# Altium project ALTIUM_{TEX139}_HV-1PH-DCAC-R3.PrjPcb (part 1 of 2)
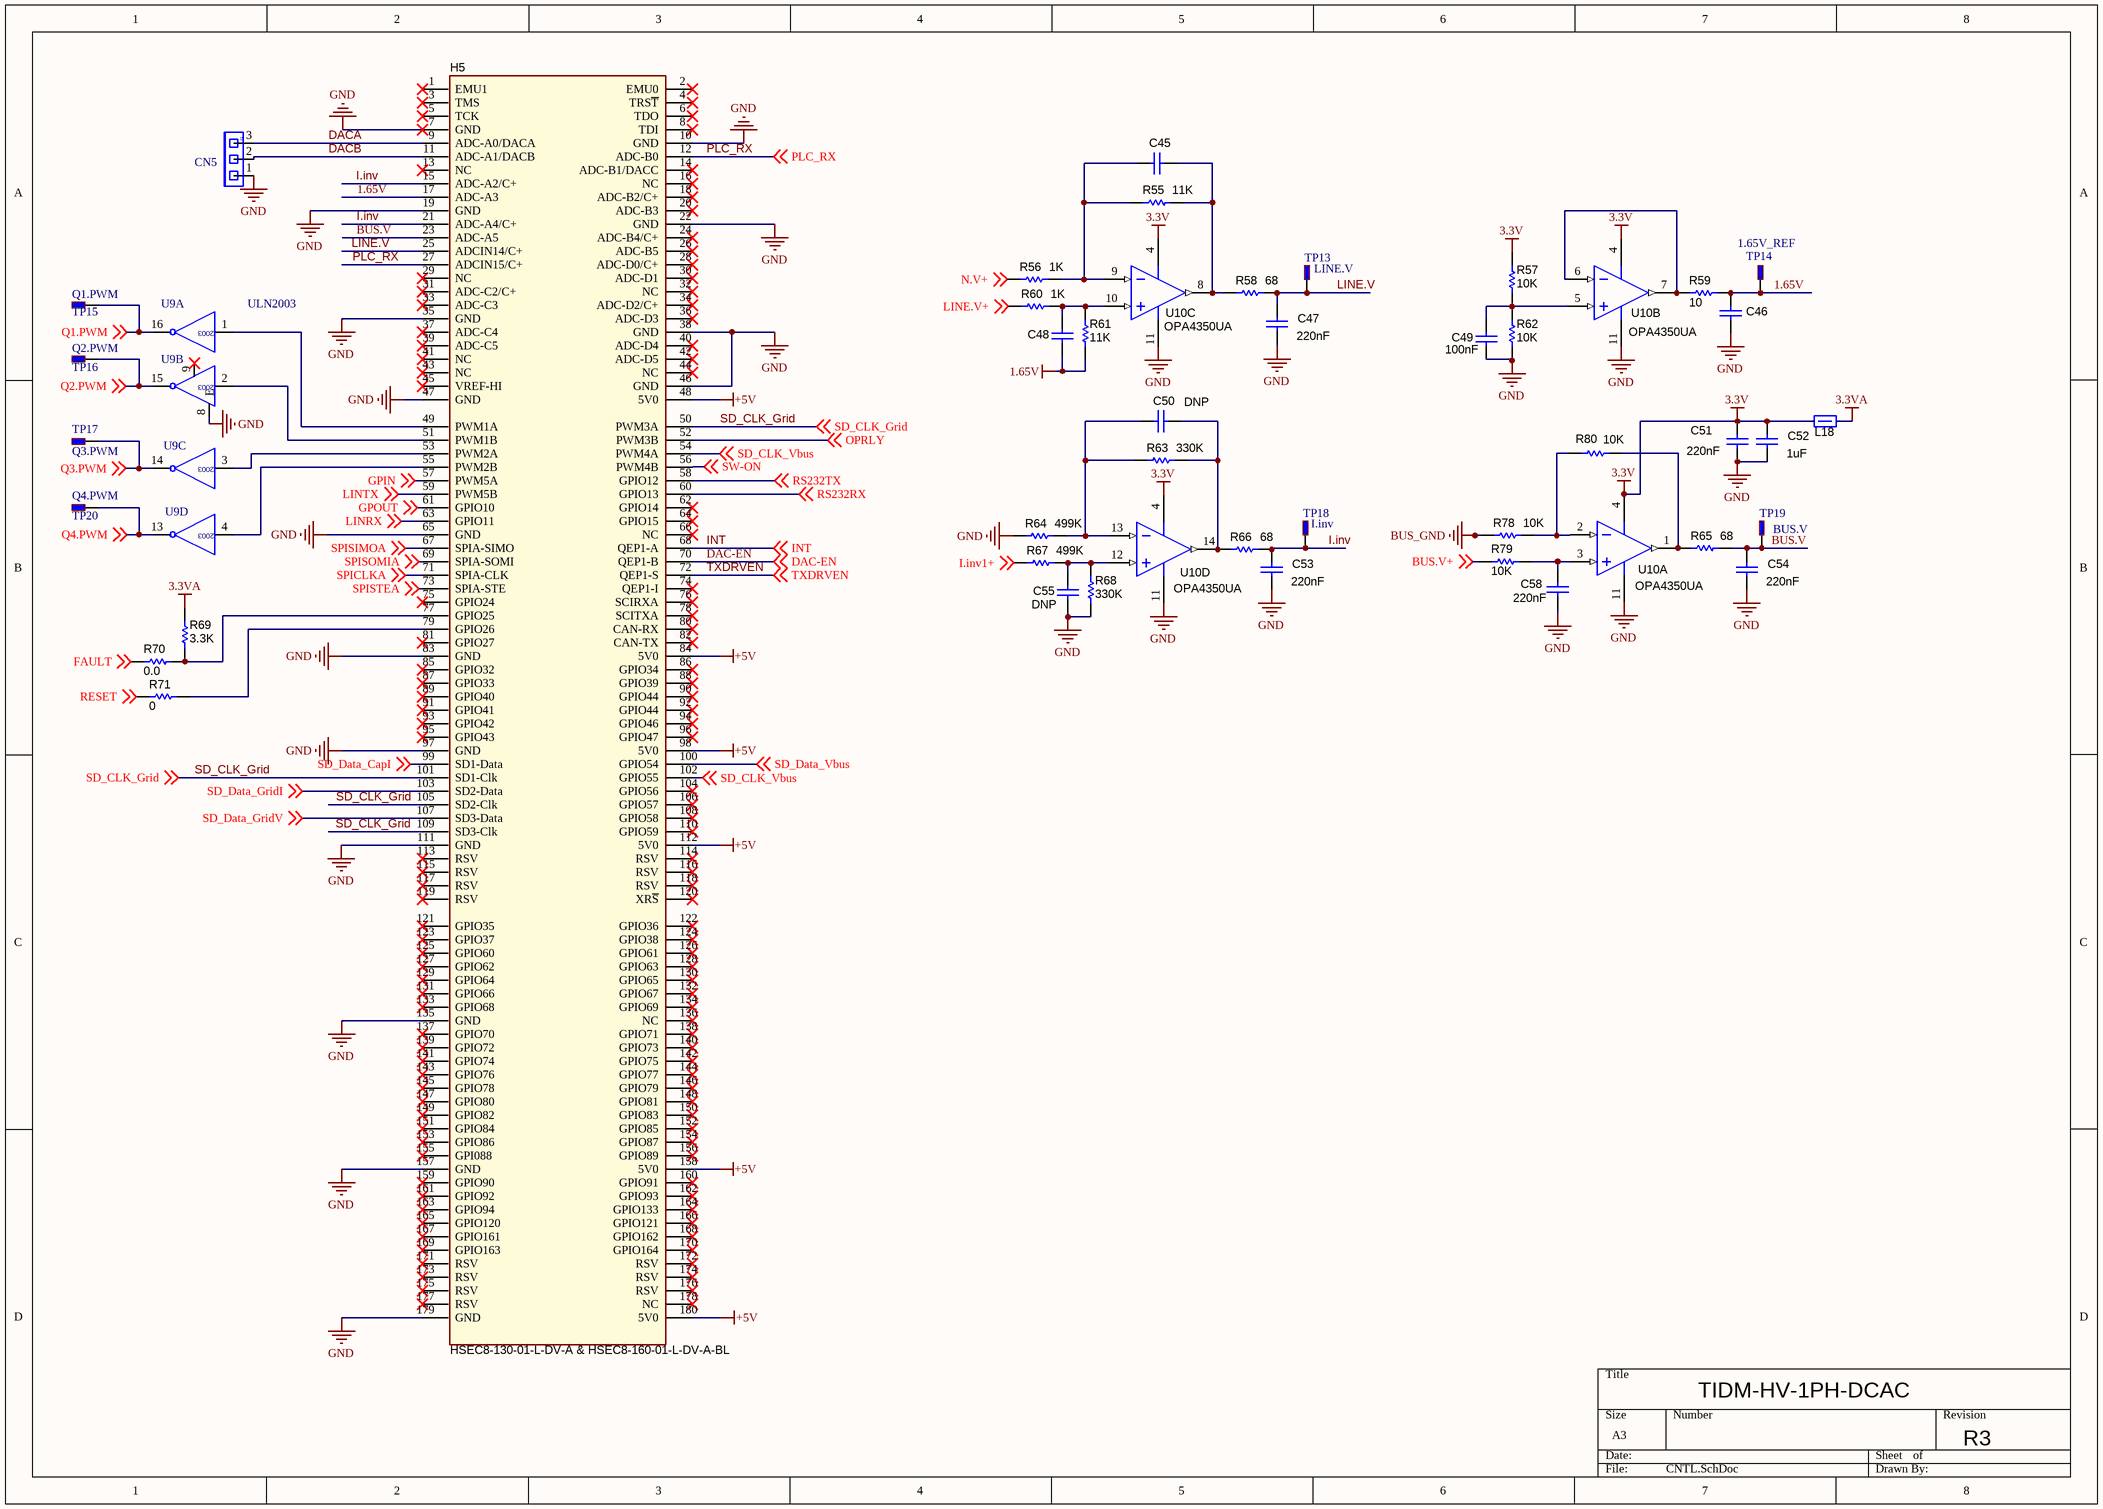
[diagram p0: CNTL.SchDoc]
3 sheets, 245 parts. Net scope: global (net labels, ports and power ports of the same name join across sheets).
Board file: ALTIUM_{TEX139}_HV-1PH-DCAC-R3.PcbDoc
Sheets:
  CNTL.SchDoc
  Main.SchDoc
  JTAG-USB-POWER.SchDoc

## Sheet CNTL.SchDoc
size A3; PageSetup: Record=PageOptions|CenterHorizontal=True|CenterVertical=True|PrintScale=0.25|XCorrection=1.00|YCorrection=1.00|PrintKind=1|BorderSize=5000000|LeftOffset=0|BottomOffset=0|Orientation=2|PaperLength=1000|PaperWidth=1000|Scale=100|PaperSource=15|PrintQuality=600|MediaType=1|DitherType=10|PaperKind=Legal|PrintScaleMode=1

### Parts
C45  Used in BOM report  [0603]  (value not drawn)
C46  Used in BOM report  [0603]  (value not drawn)
C47  value 220nF  [0603]  (hidden comment: Used in BOM report)
C48  Used in BOM report  [0603]  (value not drawn)
C49  value 100nF  [0603]  (hidden comment: Used in BOM report)
C50  value DNP  [0603]  (hidden comment: Used in BOM report)
C51  value 220nF  [0603]  (hidden comment: Used in BOM report)
C52  value 1uF  [0603]  (hidden comment: Used in BOM report)
C53  value 220nF  [0603]  (hidden comment: Used in BOM report)
C54  value 220nF  [0603]  (hidden comment: Used in BOM report)
C55  value DNP  [0603]  (hidden comment: Used in BOM report)
C58  value 220nF  [0603]  (hidden comment: Used in BOM report)
CN5  SCI_PORT  [HDR1X3]  (value not drawn)
H5  HSEC8-130-01-L-DV-A & HSEC8-160-01-L-DV-A-BL  [HEADER_HSEC8_180_DV]
L18  LQM21FN220N00L  [0805]  (value not drawn)
R55  value 11K  [0603]  (hidden comment: Used in BOM report)
R56  value 1K  [0603]  (hidden comment: Used in BOM report)
R57  value 10K  [0603]  (hidden comment: Used in BOM report)
R58  value 68  [0603]  (hidden comment: Used in BOM report)
R59  value 10  [0603]  (hidden comment: Used in BOM report)
R60  value 1K  [0603]  (hidden comment: Used in BOM report)
R61  value 11K  [0603]  (hidden comment: Used in BOM report)
R62  value 10K  [0603]  (hidden comment: Used in BOM report)
R63  value 330K  [0603]  (hidden comment: Used in BOM report)
R64  value 499K  [0603]  (hidden comment: Used in BOM report)
R65  value 68  [0603]  (hidden comment: Used in BOM report)
R66  value 68  [0603]  (hidden comment: Used in BOM report)
R67  value 499K  [0603]  (hidden comment: Used in BOM report)
R68  value 330K  [0603]  (hidden comment: Used in BOM report)
R69  value 3.3K  [0805]  (hidden comment: RC0805JR-071R1L)
R70  value 0.0  [0805]  (hidden comment: RC0805JR-071R1L)
R71  value 0  [0805]  (hidden comment: RC0805JR-071R1L)
R78  value 10K  [0603]  (hidden comment: Used in BOM report)
R79  value 10K  [0603]  (hidden comment: Used in BOM report)
R80  value 10K  [0603]  (hidden comment: Used in BOM report)
TP13  LINE.V  [PIN1]
TP14  1.65V_REF  [PIN1]
TP15  Q1.PWM  [PIN1]
TP16  Q2.PWM  [PIN1]
TP17  Q3.PWM  [PIN1]
TP18  I.inv  [PIN1]
TP19  BUS.V  [PIN1]
TP20  Q4.PWM  [PIN1]
U9  ULN2003  [2003SM]  (value not drawn)  (parts A,B,C,D of 7)
U10  OPA4350UA  [D0014A_N]  (parts A,B,C,D of 4)

### Nets
1.65V: C46.1 C48.2 H5.17(ADC-A3) R59.1 R61.1 TP14.1
3.3V: C51.1 C52.1 L18.2 R57.2 U10.4(V+)
3.3VA: L18.1 R69.2
+5V: H5.48(5V0) H5.84(5V0) H5.98(5V0) H5.112(5V0) H5.158(5V0) H5.180(5V0)
BUS_GND: R78.1  [project net Q2PWM-]
GND: C46.2 C47.2 C49.2 C51.2 C52.2 C53.2 C54.2 C55.2 C58.2 CN5.1 H5.7(GND) H5.10(GND) H5.19(GND) H5.22(GND) H5.35(GND) H5.38(GND) H5.46(GND) H5.47(GND) H5.65(GND) H5.83(GND) H5.97(GND) H5.111(GND) H5.135(GND) H5.157(GND) H5.179(GND) R62.1 R64.1 R68.1 U9.8(E) U10.11(V-)
BUS.V: C54.1 H5.23(ADC-A5) R65.2 TP19.1
BUS.V+: R79.2 ; off-sheet BUS.V+
DAC-EN: H5.70(QEP1-B) ; off-sheet DAC-EN
DACA: CN5.3 H5.9(ADC-A0/DACA)
DACB: CN5.2 H5.11(ADC-A1/DACB)
FAULT: R70.1 ; off-sheet FAULT
GPIN: H5.57(PWM5A) ; off-sheet GPIN
GPOUT: H5.61(GPIO10) ; off-sheet GPOUT
I.inv: C53.1 H5.15(ADC-A2/C+) H5.21(ADC-A4/C+) R66.2 TP18.1
I.inv1+: R67.1 ; off-sheet I.inv1+
INT: H5.68(QEP1-A) ; off-sheet INT
LINE.V: C47.1 H5.25(ADCIN14/C+) R58.2 TP13.1
LINE.V+: R60.1 ; off-sheet LINE.V+
LINRX: H5.63(GPIO11) ; off-sheet LINRX
LINTX: H5.59(PWM5B) ; off-sheet LINTX
N.V+: R56.1 ; off-sheet N.V+
OPRLY: H5.52(PWM3B) ; off-sheet OPRLY
PLC_RX: H5.12(ADC-B0) H5.27(ADCIN15/C+) ; off-sheet PLC_RX
Q1.PWM: TP15.1 U9.16 ; off-sheet Q1.PWM
Q2.PWM: TP16.1 U9.15 ; off-sheet Q2.PWM
Q3.PWM: TP17.1 U9.14 ; off-sheet Q3.PWM
Q4.PWM: TP20.1 U9.13 ; off-sheet Q4.PWM
RESET: R71.1 ; off-sheet RESET
RS232RX: H5.60(GPIO13) ; off-sheet RS232RX
RS232TX: H5.58(GPIO12) ; off-sheet RS232TX
SD_CLK_Grid: H5.50(PWM3A) H5.101(SD1-Clk) H5.105(SD2-Clk) H5.109(SD3-Clk) ; off-sheet SD_CLK_Grid
SD_CLK_Vbus: H5.54(PWM4A) H5.102(GPIO55) ; off-sheet SD_CLK_Vbus
SD_DATA_CapI: H5.99(SD1-Data) ; off-sheet SD_Data_CapI
SD_DATA_GridI: H5.103(SD2-Data) ; off-sheet SD_Data_GridI
SD_DATA_GridV: H5.107(SD3-Data) ; off-sheet SD_Data_GridV
SD_DATA_Vbus: H5.100(GPIO54) ; off-sheet SD_Data_Vbus
SPICLKA: H5.71(SPIA-CLK) ; off-sheet SPICLKA
SPISIMOA: H5.67(SPIA-SIMO) ; off-sheet SPISIMOA
SPISOMIA: H5.69(SPIA-SOMI) ; off-sheet SPISOMIA
SPISTEA: H5.73(SPIA-STE) ; off-sheet SPISTEA
SW-ON: H5.56(PWM4B) ; off-sheet SW-ON
TXDRVEN: H5.72(QEP1-S) ; off-sheet TXDRVEN
NetC45_1: C45.1 R55.1 R56.2 U10.9(IN_C-)
NetC45_2: C45.2 R55.2 R58.1 U10.8(OUT_C)
NetC48_1: C48.1 R60.2 R61.2 U10.10(IN_C+)
NetC49_1: C49.1 R57.1 R62.2 U10.5(IN_B+)
NetC50_1: C50.1 R63.1 R64.2 U10.13(IN_D-)
NetC50_2: C50.2 R63.2 R66.1 U10.14(OUT_D)
NetC55_1: C55.1 R67.2 R68.2 U10.12(IN_D+)
NetC58_1: C58.1 R79.1 U10.3(IN_A+)
NetH5_49: H5.49(PWM1A) U9.1
NetH5_51: H5.51(PWM1B) U9.2
NetH5_53: H5.53(PWM2A) U9.3
NetH5_55: H5.55(PWM2B) U9.4
NetH5_77: H5.77(GPIO25) R69.1 R70.2
NetH5_79: H5.79(GPIO26) R71.2
NetR59_2: R59.2 U10.6(IN_B-) U10.7(OUT_B)
NetR65_1: R65.1 R80.2 U10.1(OUT_A)
NetR78_2: R78.2 R80.1 U10.2(IN_A-)

Not connected (* = marked no-connect by the designer): H5 1(EMU1)* 2(EMU0)* 3(TMS)* 4(TRS~{T})* 5(TCK)* 6(TDO)* 8(TDI)* 13(NC)* 14(ADC-B1/DACC)* 16(NC)* 18(ADC-B2/C+)* 20(ADC-B3)* 24(ADC-B4/C+)* 26(ADC-B5)* 28(ADC-D0/C+)* 29(NC)* 30(ADC-D1)* 31(ADC-C2/C+)* 32(NC)* 33(ADC-C3)* 34(ADC-D2/C+)* 36(ADC-D3)* 37(ADC-C4)* 39(ADC-C5)* 40(ADC-D4)* 41(NC)* 42(ADC-D5)* 43(NC)* 44(NC)* 45(VREF-HI)* 62(GPIO14)* 64(GPIO15)* 66(NC)* 74(QEP1-I)* 75(GPIO24)* 76(SCIRXA)* 78(SCITXA)* 80(CAN-RX)* 81(GPIO27)* 82(CAN-TX)* 85(GPIO32)* 86(GPIO34)* 87(GPIO33)* 88(GPIO39)* 89(GPIO40)* 90(GPIO44)* 91(GPIO41)* 92(GPIO44)* 93(GPIO42)* 94(GPIO46)* 95(GPIO43)* 96(GPIO47)* 104(GPIO56)* 106(GPIO57)* 108(GPIO58)* 110(GPIO59)* 113(RSV)* 114(RSV)* 115(RSV)* 116(RSV)* 117(RSV)* 118(RSV)* 119(RSV)* 120(XR~{S})* 121(GPIO35)* 122(GPIO36)* 123(GPIO37)* 124(GPIO38)* 125(GPIO60)* 126(GPIO61)* 127(GPIO62)* 128(GPIO63)* 129(GPIO64)* 130(GPIO65)* 131(GPIO66)* 132(GPIO67)* 133(GPIO68)* 134(GPIO69)* 136(NC)* 137(GPIO70)* 138(GPIO71)* 139(GPIO72)* 140(GPIO73)* 141(GPIO74)* 142(GPIO75)* 143(GPIO76)* 144(GPIO77)* 145(GPIO78)* 146(GPIO79)* 147(GPIO80)* 148(GPIO81)* 149(GPIO82)* 150(GPIO83)* 151(GPIO84)* 152(GPIO85)* 153(GPIO86)* 154(GPIO87)* 155(GPI088)* 156(GPIO89)* 159(GPIO90)* 160(GPIO91)* 161(GPIO92)* 162(GPIO93)* 163(GPIO94)* 164(GPIO133)* 165(GPIO120)* 166(GPIO121)* 167(GPIO161)* 168(GPIO162)* 169(GPIO163)* 170(GPIO164)* 171(RSV)* 172(RSV)* 173(RSV)* 174(RSV)* 175(RSV)* 176(RSV)* 177(RSV)* 178(NC)*; U9 9(COM)

### Notes on the sheet
- TIDM-HV-1PH-DCAC
- R3
- (in symbol 2003SM, part A) 2003
- (in symbol 2003SM, part B) 2003
- (in symbol 2003SM, part C) 2003
- (in symbol 2003SM, part D) 2003
- (in symbol DB01P03) F

### Library data of the parts
C45 C47-C55 C58 = Capacitor: CAP, CERM, xxxF, xxV, [TempCo], xx%, [PackageReference]; Polarized: N; U/M: EA; CompType: Capacitor; SymbolVersion: 2008-07-09; PackageReference: Used in PnP output; Manufacturer: Used in BOM report; PartNumber: Used in BOM report; RoHS: Used in BOM report.  Use Y or N.; MountType: SMT or TH (used in PnP report); ComponentLink1Description: Datasheet Link; ComponentLink1URL: Paste URL for datasheet here; Publisher: Texas Instruments; LatestRevisionDate: 2014-06-06; LatestRevisionNote: Added Alternate PartNumber and Alternate Manufacturer parameters to appropriate components.; Alternate Manufacturer: -; Alternate PartNumber: -
  C45 C48: Value: *
C46 = Capacitor: CAP, CERM, xxxF, xxV, [TempCo], xx%, [PackageReference]; Polarized: N; Value: 10nF; U/M: EA; CompType: Capacitor; SymbolVersion: 2008-07-09; PackageReference: Used in PnP output; Manufacturer: Used in BOM report; PartNumber: Used in BOM report; RoHS: Used in BOM report.  Use Y or N.; MountType: SMT or TH (used in PnP report); ComponentLink1Description: Datasheet Link; ComponentLink1URL: Paste URL for datasheet here; Publisher: Texas Instruments; LatestRevisionDate: 2014-06-06; LatestRevisionNote: Added Alternate PartNumber and Alternate Manufacturer parameters to appropriate components.; Alternate Manufacturer: -; Alternate PartNumber: -
CN5 = DB01P03: Value: SCI_PORT
H5 = HEADER_HSEC_180_F2837x_HVDCACSolar: Manufacturer: Samtech; SymbolVersion: use current date i.e. 2008-05-20; SymbolCreator: Use a-id; CompType: Used in some BOM reports.  Useful for finding later.; U/M: EA, IN, or GM; MountType: SMT, TH, or N/A; RoHS: Used in BOM report.  Use Y or N.; PartNumber: HSEC8-130-01-L-DV-A & HSEC8-160-01-L-DV-A-BL; PackageReference: eg:  0603, used in PnP report; ComponentLink1Description: Datasheet Link; Alternate PartNumber: -; Alternate Manufacturer: -
L18 = MMZ2012R300A: Ferrite Bead, 30 ohm @ 100MHz, 1.5A, 0805; Manufacturer: Murata; Value: 22µH; DCR_ohm: 0.350; CompType: Ferrite Bead; SymbolVersion: 2009-06-02; PartNumber: LQM21FN220N00L; MountType: SMT; PackageReference: 0805; Published: 2014-04-30; Publisher: Texas Instruments; LatestRevisionDate: 2014-04-30; ComponentLink1Description: Datasheet link; ComponentLink1URL: http://www.digikey.com/product-detail/en/LQM21FN220N00L/490-4030-1-ND/1016290; RoHS: Y; Supplier 1: Digi-Key; Supplier Part Number 1: 490-4030-1-ND; Supplier 2: Mouser; Supplier 3: Farnell
R55 R56 R58-R61 R65 R66 R78-R80 = Resistor: RES, 1K ohm, x%, xW, [PackageReference]; U/M: EA; CompType: Resistor; SymbolVersion: 2009-05-29; PackageReference: Used in PnP output; Manufacturer: Used in BOM report; PartNumber: Used in BOM report; RoHS: Used in BOM report.  Use Y or N.; MountType: SMT or TH (used in PnP report); ComponentLink1Description: Datasheet Link; ComponentLink1URL: Paste URL for datasheet here; Publisher: Texas Instruments; LatestRevisionDate: 2014-06-06; LatestRevisionNote: Added Alternate PartNumber and Alternate Manufacturer parameters to appropriate components.; Alternate Manufacturer: -; Alternate PartNumber: -
R57 R62 = Resistor: RES, 10K ohm, x%, xW, [PackageReference]; U/M: EA; CompType: Resistor; SymbolVersion: 2009-05-29; PackageReference: Used in PnP output; Manufacturer: Used in BOM report; PartNumber: Used in BOM report; RoHS: Used in BOM report.  Use Y or N.; MountType: SMT or TH (used in PnP report); ComponentLink1Description: Datasheet Link; ComponentLink1URL: Paste URL for datasheet here; Publisher: Texas Instruments; LatestRevisionDate: 2014-06-06; LatestRevisionNote: Added Alternate PartNumber and Alternate Manufacturer parameters to appropriate components.; Alternate Manufacturer: -; Alternate PartNumber: -
R63 R68 = Resistor: RES, 330K ohm, x%, xW, [PackageReference]; U/M: EA; CompType: Resistor; SymbolVersion: 2009-05-29; PackageReference: Used in PnP output; Manufacturer: Used in BOM report; PartNumber: Used in BOM report; RoHS: Used in BOM report.  Use Y or N.; MountType: SMT or TH (used in PnP report); ComponentLink1Description: Datasheet Link; ComponentLink1URL: Paste URL for datasheet here; Publisher: Texas Instruments; LatestRevisionDate: 2014-06-06; LatestRevisionNote: Added Alternate PartNumber and Alternate Manufacturer parameters to appropriate components.; Alternate Manufacturer: -; Alternate PartNumber: -
R64 R67 = Resistor: RES, 499K ohm, x%, xW, [PackageReference]; U/M: EA; CompType: Resistor; SymbolVersion: 2009-05-29; PackageReference: Used in PnP output; Manufacturer: Used in BOM report; PartNumber: Used in BOM report; RoHS: Used in BOM report.  Use Y or N.; MountType: SMT or TH (used in PnP report); ComponentLink1Description: Datasheet Link; ComponentLink1URL: Paste URL for datasheet here; Publisher: Texas Instruments; LatestRevisionDate: 2014-06-06; LatestRevisionNote: Added Alternate PartNumber and Alternate Manufacturer parameters to appropriate components.; Alternate Manufacturer: -; Alternate PartNumber: -
R69 = RC0805JR-071R1L: RES, 3.3Kohm, 5%, 0.125W, 0805; Manufacturer: Yageo America; CompType: Resistor; Res_ohm: 3.3; Value_Code: 1R10; Tolerance_%: 5; Power_W: 0.125; VDC_V: 150; TempCo: 200 ppm/C; EIA_Code: E24; U/M: EA; SymbolVersion: 2009-05-29; PartNumber: RC0805JR-071R1L; PackageReference: 0805; RoHS: Y; Value1: 5%; Value2: 0.125W; MountType: SMT; Technology: Thick Film; Published: 2008-06-26; Publisher: Texas Instruments; LatestRevisionDate: 2014-04-18; ComponentLink1Description: Datasheet link; ComponentLink1URL: http://www.yageo.com/pdf/Pu-RC0805_51_PbFree_L_2.pdf; Supplier 1: Digi-Key; Supplier Part Number 1: 311-1.1ARCT-ND; Supplier 2: Mouser; Supplier Part Number 2: 603-RC0805JR-071R1L; Supplier 3: Farnell; Supplier Part Number 3: 1799483
R70 = RC0805JR-071R1L: RES, 0 ohm, 5%, 0.125W, 0805; Manufacturer: Yageo America; CompType: Resistor; Res_ohm: 0; Value_Code: 1R10; Tolerance_%: 5; Power_W: 0.125; VDC_V: 150; TempCo: 200 ppm/C; EIA_Code: E24; U/M: EA; SymbolVersion: 2009-05-29; PartNumber: RC0805JR-071R1L; PackageReference: 0805; RoHS: Y; Value1: 5%; Value2: 0.125W; MountType: SMT; Technology: Thick Film; Published: 2008-06-26; Publisher: Texas Instruments; LatestRevisionDate: 2014-04-18; ComponentLink1Description: Datasheet link; ComponentLink1URL: http://www.yageo.com/pdf/Pu-RC0805_51_PbFree_L_2.pdf; Supplier 1: Digi-Key; Supplier Part Number 1: 311-1.1ARCT-ND; Supplier 2: Mouser; Supplier Part Number 2: 603-RC0805JR-071R1L; Supplier 3: Farnell; Supplier Part Number 3: 1799483
R71 = RC0805JR-071R1L: RES, 0.0 ohm, 5%, 0.125W, 0805; Manufacturer: Yageo America; CompType: Resistor; Value_Code: 1R10; Tolerance_%: 5; Power_W: 0.125; VDC_V: 150; TempCo: 200 ppm/C; EIA_Code: E24; U/M: EA; SymbolVersion: 2009-05-29; PartNumber: RC0805JR-071R1L; PackageReference: 0805; RoHS: Y; Res_ohm: 0; Value1: 5%; Value2: 0.125W; MountType: SMT; Technology: Thick Film; Published: 2008-06-26; Publisher: Texas Instruments; LatestRevisionDate: 2014-04-18; ComponentLink1Description: Datasheet link; ComponentLink1URL: http://www.yageo.com/pdf/Pu-RC0805_51_PbFree_L_2.pdf; Supplier 1: Digi-Key; Supplier Part Number 1: 311-1.1ARCT-ND; Supplier 2: Mouser; Supplier Part Number 2: 603-RC0805JR-071R1L; Supplier 3: Farnell; Supplier Part Number 3: 1799483
TP13-TP20 = PIN1: ZR
U9 = 2003SM: Value: {Value}
U10 = OPA4350UA: High-Speed, Single-Supply, Rail-to-Rail Operational Amplifier MicroAmplifier(TM) Series, 2.7 to 5.5 V, -55 to 150 degC, 14-pin SOIC (D0014A), Green (RoHS & no Sb/Br); Manufacturer: Texas Instruments; Alternate Manufacturer: None; Alternate PartNumber: Equivalent; CMRR(Min)(dB): 66; IIB(Max)(pA): 10; Iq per channel(Max)(mA): 7.5; Number of Channels: 4; Slew Rate(Typ)(V/us): 22; Sub Family: Low Input Bias Current Amp (<=10pA), Low Offset Voltage Amplifier (<=500uV), Low Supply Voltage Amplifier (<=2.7V), Precision Amplifier; Total Supply Voltage(Max)(+5V is 5, +/-5V is 10): 5.5; Total Supply Voltage(Min)(+5V is 5, +/-5V is 10): 2.7; Vio (25C)(Max)(mV): 0.5; Vn at 1kHz(Typ)(nV/rtHz): 18; DatasheetVersion: SBOS099C; PackageVersion: 4040047-5/M, 06/2011; PackageReference: D0014A; PackageDescription: 14-Pin Plastic Small Outline, Body 8.65 x 3.9 mm, Pitch 1.27 mm; Supplier 1: Digi-Key; Supplier Part Number 1: OPA4350UA-ND; Supplier 2: Farnell; Supplier Part Number 2: 1097445; Supplier 3: Newark; Supplier Part Number 3: 74K3912; Supplier 4: Mouser; Supplier Part Number 4: 595-OPA4350UA; Eco-Plan: Green (RoHS & no Sb/Br); Offset Drift(Typ)(uV/C): 4; MountType: SMT; Code_JEDEC: MS-012; PartNumber: OPA4350UA; ComponentLink1Description: Manufacturer URL; ComponentLink1URL: http://www.ti.com/; ComponentLink2Description: Datasheet; ComponentLink2URL: http://www.ti.com/general/docs/lit/getliterature.tsp?genericPartNumber=OPA4350&fileType=pdf; ComponentLink3Description: Package Specification; ComponentLink3URL: http://www.ti.com/lit/ml/mpds177g/mpds177g.pdf

## Sheet Main.SchDoc
size 444 x 330 mm; PageSetup: Record=PageOptions|CenterHorizontal=True|CenterVertical=True|PrintScale=0.62|XCorrection=1.00|YCorrection=1.00|PrintKind=1|BorderSize=5000000|LeftOffset=0|BottomOffset=0|Orientation=2|PaperLength=1000|PaperWidth=1000|Scale=100|PaperSource=15|PrintQuality=600|MediaType=1|DitherType=10|PaperKind=Legal|PrintScaleMode=1
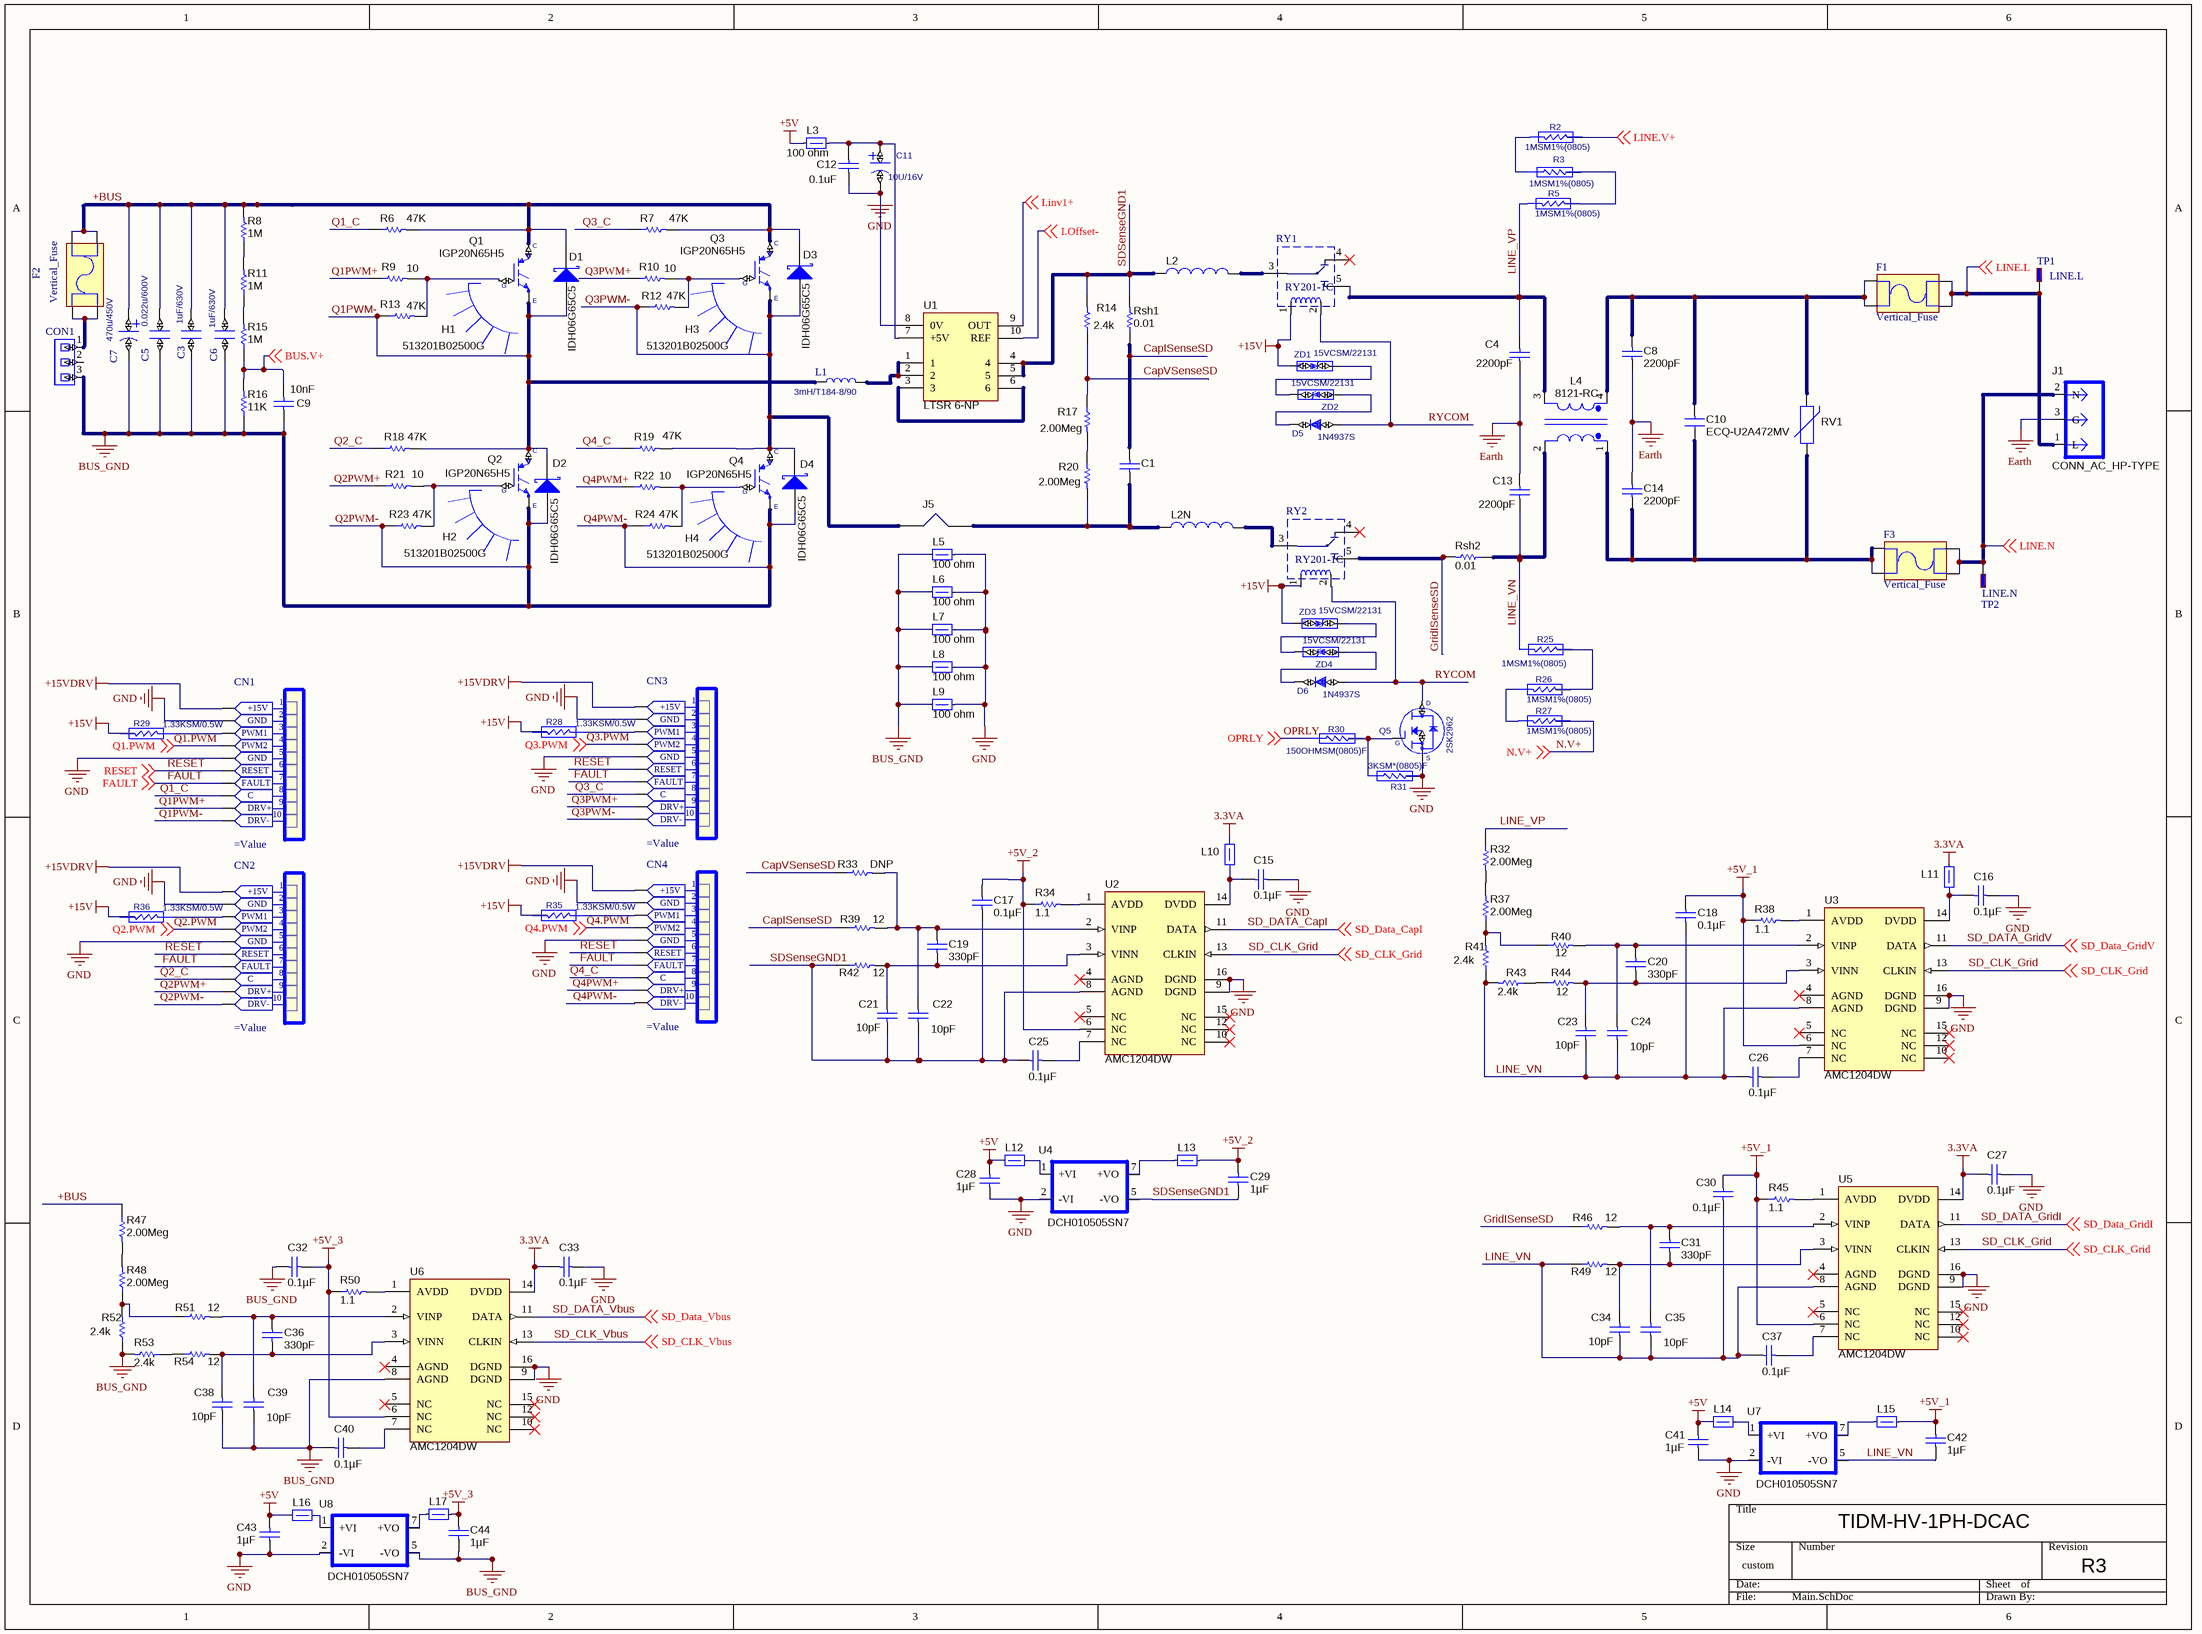
[diagram p1: Main.SchDoc]

### Parts
C1  See BOM  [ACCap_HV_DCACBoard]  (value not drawn)
C3  1uF/630V  [CAP-P10-13X4.5]
C4  ValueDisplayed: 2200pF  [2220]  (hidden comment: GA355QR7GF222KW01L)
C5  0.022u/600V  [CAP-P10-13X4.5]
C6  1uF/630V  [CAP-P10-13X4.5]
C7  470u/450V  [CE1035P2]
C8  ValueDisplayed: 2200pF  [2220]  (hidden comment: GA355QR7GF222KW01L)
C9  value 10nF  [0805]  (hidden comment: Used in BOM report)
C10  ECQ-U2A472MV  [ECQ-U2A472MV]
C11  10U/16V  [CAP-3528]
C12  value 0.1uF  [0805]  (hidden comment: Used in BOM report)
C13  ValueDisplayed: 2200pF  [2220]  (hidden comment: GA355QR7GF222KW01L)
C14  ValueDisplayed: 2200pF  [2220]  (hidden comment: GA355QR7GF222KW01L)
C15  ValueDisplayed: 0.1µF  [0805]  (hidden comment: GRM219R71C104KA01D)
C16  ValueDisplayed: 0.1µF  [0805]  (hidden comment: GRM219R71C104KA01D)
C17  ValueDisplayed: 0.1µF  [0805]  (hidden comment: GRM219R71C104KA01D)
C18  ValueDisplayed: 0.1µF  [0805]  (hidden comment: GRM219R71C104KA01D)
C19  ValueDisplayed: 330pF  [0805_HV]  (hidden comment: 08055C331KAT2A)
C20  ValueDisplayed: 330pF  [0805_HV]  (hidden comment: 08055C331KAT2A)
C21  ValueDisplayed: 10pF  [0805_HV]  (hidden comment: 08055A100JAT2A)
C22  ValueDisplayed: 10pF  [0805_HV]  (hidden comment: 08055A100JAT2A)
C23  ValueDisplayed: 10pF  [0805_HV]  (hidden comment: 08055A100JAT2A)
C24  ValueDisplayed: 10pF  [0805_HV]  (hidden comment: 08055A100JAT2A)
C25  ValueDisplayed: 0.1µF  [0805]  (hidden comment: GRM219R71C104KA01D)
C26  ValueDisplayed: 0.1µF  [0805]  (hidden comment: GRM219R71C104KA01D)
C27  ValueDisplayed: 0.1µF  [0805]  (hidden comment: GRM219R71C104KA01D)
C28  ValueDisplayed: 1µF  [0805]  (hidden comment: TMK212BJ105KG-T)
C29  ValueDisplayed: 1µF  [0805]  (hidden comment: TMK212BJ105KG-T)
C30  ValueDisplayed: 0.1µF  [0805]  (hidden comment: GRM219R71C104KA01D)
C31  ValueDisplayed: 330pF  [0805_HV]  (hidden comment: 08055C331KAT2A)
C32  ValueDisplayed: 0.1µF  [0805]  (hidden comment: GRM219R71C104KA01D)
C33  ValueDisplayed: 0.1µF  [0805]  (hidden comment: GRM219R71C104KA01D)
C34  ValueDisplayed: 10pF  [0805_HV]  (hidden comment: 08055A100JAT2A)
C35  ValueDisplayed: 10pF  [0805_HV]  (hidden comment: 08055A100JAT2A)
C36  ValueDisplayed: 330pF  [0805_HV]  (hidden comment: 08055C331KAT2A)
C37  ValueDisplayed: 0.1µF  [0805]  (hidden comment: GRM219R71C104KA01D)
C38  ValueDisplayed: 10pF  [0805_HV]  (hidden comment: 08055A100JAT2A)
C39  ValueDisplayed: 10pF  [0805_HV]  (hidden comment: 08055A100JAT2A)
C40  ValueDisplayed: 0.1µF  [0805]  (hidden comment: GRM219R71C104KA01D)
C41  ValueDisplayed: 1µF  [0805]  (hidden comment: TMK212BJ105KG-T)
C42  ValueDisplayed: 1µF  [0805]  (hidden comment: TMK212BJ105KG-T)
C43  ValueDisplayed: 1µF  [0805]  (hidden comment: TMK212BJ105KG-T)
C44  ValueDisplayed: 1µF  [0805]  (hidden comment: TMK212BJ105KG-T)
CN1  (no value)  [HDR1X10]
CN2  (no value)  [HDR1X10]
CN3  (no value)  [HDR1X10]
CN4  (no value)  [HDR1X10]
CON1  {Value}  [CN3P/7.62]  (value not drawn)
D1  IDH06G65C5  [TO-220-2]
D2  IDH06G65C5  [TO-220-2]
D3  IDH06G65C5  [TO-220-2]
D4  IDH06G65C5  [TO-220-2]
D5  1N4937S  [D10626A]
D6  1N4937S  [D10626A]
F1  Vertical_Fuse  [Vertical_Fuse]
F2  Vertical_Fuse  [Vertical_Fuse]
F3  Vertical_Fuse  [Vertical_Fuse]
H1  513201B02500G  [HSINK_513201B02500]
H2  513201B02500G  [HSINK_513201B02500]
H3  513201B02500G  [HSINK_513201B02500]
H4  513201B02500G  [HSINK_513201B02500]
J1  CONN_AC_HP-TYPE  [CONN_AC_HP-TYPE]
J5  Used in BOM report  [PwrShort]  (value not drawn)
L1  3mH/T184-8/90  [Inductor-57x30]
L2  (no value)  [1140-471K-RC]
L2N  (no value)  [1140-471K-RC]
L3  value 100 ohm  [1206]  (hidden comment: HI1206N101R-10)
L4  8121-RC  [8121-RC]
L5  value 100 ohm  [1206]  (hidden comment: HI1206N101R-10)
L6  value 100 ohm  [1206]  (hidden comment: HI1206N101R-10)
L7  value 100 ohm  [1206]  (hidden comment: HI1206N101R-10)
L8  value 100 ohm  [1206]  (hidden comment: HI1206N101R-10)
L9  value 100 ohm  [1206]  (hidden comment: HI1206N101R-10)
L10  LQM21FN220N00L  [0805]  (value not drawn)
L11  LQM21FN220N00L  [0805]  (value not drawn)
L12  LQM21FN220N00L  [0805]  (value not drawn)
L13  LQM21FN220N00L  [0805]  (value not drawn)
L14  LQM21FN220N00L  [0805]  (value not drawn)
L15  LQM21FN220N00L  [0805]  (value not drawn)
L16  LQM21FN220N00L  [0805]  (value not drawn)
L17  LQM21FN220N00L  [0805]  (value not drawn)
Q1  IGP20N65H5  [TO-220]
Q2  IGP20N65H5  [TO-220]
Q3  IGP20N65H5  [TO-220]
Q4  IGP20N65H5  [TO-220]
Q5  2SK2962  [FET350R]
R2  1MSM1%(0805)  [R0805BSM]
R3  1MSM1%(0805)  [R0805BSM]
R5  1MSM1%(0805)  [R0805BSM]
R6  value 47K  [1210]
R7  value 47K  [1210]
R8  value 1M  [0805]  (hidden comment: Used in BOM report)
R9  value 10  [1210]
R10  value 10  [1210]
R11  value 1M  [0805]  (hidden comment: Used in BOM report)
R12  value 47K  [1210]
R13  value 47K  [1210]
R14  value 2.4k  [0805]  (hidden comment: CRCW08051K62FKEA)
R15  value 1M  [0805]  (hidden comment: Used in BOM report)
R16  value 11K  [0805]  (hidden comment: Used in BOM report)
R17  value 2.00Meg  [0805]  (hidden comment: CRCW08051M00FKEA)
R18  value 47K  [1210]
R19  value 47K  [1210]
R20  value 2.00Meg  [0805]  (hidden comment: CRCW08051M00FKEA)
R21  value 10  [1210]
R22  value 10  [1210]
R23  value 47K  [1210]
R24  value 47K  [1210]
R25  1MSM1%(0805)  [R0805BSM]
R26  1MSM1%(0805)  [R0805BSM]
R27  1MSM1%(0805)  [R0805BSM]
R28  1.33KSM/0.5W  [R/1210]
R29  1.33KSM/0.5W  [R/1210]
R30  150OHMSM(0805)F  [R0805BSM]
R31  3KSM*(0805)F  [R0805BSM]
R32  value 2.00Meg  [0805M]  (hidden comment: CRCW08051M00FKEA)
R33  value DNP  [0805_HV]  (hidden comment: CRCW080512R0JNEA)
R34  value 1.1  [0805]  (hidden comment: RC0805JR-071R1L)
R35  1.33KSM/0.5W  [R/1210]
R36  1.33KSM/0.5W  [R/1210]
R37  value 2.00Meg  [0805M]  (hidden comment: CRCW08051M00FKEA)
R38  value 1.1  [0805]  (hidden comment: RC0805JR-071R1L)
R39  value 12  [0805_HV]  (hidden comment: CRCW080512R0JNEA)
R40  value 12  [0805_HV]  (hidden comment: CRCW080512R0JNEA)
R41  value 2.4k  [0805_HV]  (hidden comment: CRCW08051K62FKEA)
R42  value 12  [0805_HV]  (hidden comment: CRCW080512R0JNEA)
R43  value 2.4k  [0805_HV]  (hidden comment: CRCW08051K62FKEA)
R44  value 12  [0805_HV]  (hidden comment: CRCW080512R0JNEA)
R45  value 1.1  [0805]  (hidden comment: RC0805JR-071R1L)
R46  value 12  [0805_HV]  (hidden comment: CRCW080512R0JNEA)
R47  value 2.00Meg  [0805M]  (hidden comment: CRCW08051M00FKEA)
R48  value 2.00Meg  [0805M]  (hidden comment: CRCW08051M00FKEA)
R49  value 12  [0805_HV]  (hidden comment: CRCW080512R0JNEA)
R50  value 1.1  [0805]  (hidden comment: RC0805JR-071R1L)
R51  value 12  [0805_HV]  (hidden comment: CRCW080512R0JNEA)
R52  value 2.4k  [0805_HV]  (hidden comment: CRCW08051K62FKEA)
R53  value 2.4k  [0805_HV]  (hidden comment: CRCW08051K62FKEA)
R54  value 12  [0805_HV]  (hidden comment: CRCW080512R0JNEA)
Rsh1  value 0.01  [2512M]  (hidden comment: 73M1R010F)
Rsh2  value 0.01  [2512M]  (hidden comment: 73M1R010F)
RV1  S10K275E2  [VAR_S10K275E2]  (value not drawn)
RY1  (no value)  [RELAY-G5LA-1]
RY2  (no value)  [RELAY-G5LA-1]
TP1  LINE.L  [PIN1]
TP2  LINE.N  [PIN1]
U1  LTSR 6-NP  [LTSR6-NP]
U2  AMC1204DW  [DW0016A_N]
U3  AMC1204DW  [DW0016A_N]
U4  DCH010505SN7  [EDJ-4P]
U5  AMC1204DW  [DW0016A_N]
U6  AMC1204DW  [DW0016A_N]
U7  DCH010505SN7  [EDJ-4P]
U8  DCH010505SN7  [EDJ-4P]
ZD1  15VCSM/22131  [ZD123BSM]
ZD2  15VCSM/22131  [ZD123BSM]
ZD3  15VCSM/22131  [ZD123BSM]
ZD4  15VCSM/22131  [ZD123BSM]

### Nets
3.3VA: C27.2 C33.2 L10.2 L11.2 U5.14(DVDD) U6.14(DVDD)
+5V: C28.1 C41.1 C43.1 L3.1 L12.1 L14.1 L16.1
+5V_1: C18.2 C30.2 C42.1 L15.2 R38.1 R45.1 U3.6(NC) U5.6(NC)
+5V_2: C17.2 C29.1 L13.2 R34.1 U2.6(NC)
+5V_3: C32.2 C44.1 L17.2 R50.1 U6.6(NC)
+15V: R28.2 R29.2 R35.2 R36.2 RY1.1 RY2.1 ZD1.1 ZD3.1
+15VDRV: CN1.1 CN2.1 CN3.1 CN4.1
Earth: C4.2 C8.2 C13.1 C14.1 J1.3(G)
GND: C11.2 C12.2 C15.1 C16.1 C27.1 C28.2 C33.1 C41.2 C43.2 CN1.2 CN1.5 CN2.2 CN2.5 CN3.2 CN3.5 CN4.2 CN4.5 L5.2 L6.2 L7.2 L8.2 L9.2 Q5.1 R31.2 U1.8(0V) U2.9(DGND) U2.16(DGND) U3.9(DGND) U3.16(DGND) U4.2(-VI) U5.9(DGND) U5.16(DGND) U6.9(DGND) U6.16(DGND) U7.2(-VI) U8.2(-VI)
Q2PWM-: C3.1 C5.1 C6.1 C7.2 C9.2 C32.1 C38.2 C39.2 C40.1 C44.2 CN2.10 CN4.10 CON1.3 D2.2(A) D4.2(A) L5.1 L6.1 L7.1 L8.1 L9.1 Q2.3 Q4.3 R16.1 R23.1 R24.1 R52.1 R53.2 U6.8(AGND) U8.5(-VO)  [also labelled BUS_GND, Q4PWM-]
+BUS: C3.2 C5.2 C6.2 C7.1 D1.1(K) D3.1(K) F2.3 F2.4 Q1.2 Q3.2 R6.2 R7.2 R8.2 R47.1
BUS.V+: C9.1 R15.1 R16.2 ; off-sheet BUS.V+
CapISenseSD: C1.1 R39.1 Rsh1.1
CapVSenseSD: R14.1 R17.1 R33.1
FAULT: CN1.7 CN2.7 CN3.7 CN4.7 ; off-sheet FAULT
GridISenseSD: R46.1 Rsh2.2 RY2.5
I.inv1+: U1.9(OUT) ; off-sheet I.inv1+
I.Offset-: U1.10(REF) ; off-sheet I.Offset-
LINE.L: F1.3 F1.4 J1.1(L) TP1.1 ; off-sheet LINE.L
LINE.N: F3.3 F3.4 J1.2(N) TP2.1 ; off-sheet LINE.N
LINE.V+: R2.2 ; off-sheet LINE.V+
LINE_VN: C13.2 C18.1 C23.2 C24.2 C26.1 C30.1 C34.2 C35.2 C37.1 C42.2 L4.2 R25.1 R41.1 R43.2 R49.1 Rsh2.1 U3.8(AGND) U5.8(AGND) U7.5(-VO)
LINE_VP: C4.1 L4.3 R5.1 R32.1 RY1.5
N.V+: R27.2 ; off-sheet N.V+
OPRLY: R30.1 ; off-sheet OPRLY
Q1.PWM: CN1.4 ; off-sheet Q1.PWM
Q1_C: CN1.8 R6.1
Q1PWM+: CN1.9 R9.1
Q1PWM-: CN1.10 D1.2(A) D2.1(K) L1.1 Q1.3 Q2.2 R13.1 R18.2
Q2.PWM: CN2.4 ; off-sheet Q2.PWM
Q2_C: CN2.8 R18.1
Q2PWM+: CN2.9 R21.1
Q3.PWM: CN3.4 ; off-sheet Q3.PWM
Q3_C: CN3.8 R7.1
Q3PWM+: CN3.9 R10.1
Q3PWM-: CN3.10 D3.2(A) D4.1(K) J5.1 Q3.3 Q4.2 R12.1 R19.2
Q4.PWM: CN4.4 ; off-sheet Q4.PWM
Q4_C: CN4.8 R19.1
Q4PWM+: CN4.9 R22.1
RESET: CN1.6 CN2.6 CN3.6 CN4.6 ; off-sheet RESET
RYCOM: D5.1 D6.1 Q5.2 RY1.2 RY2.2
SD_CLK_Grid: U2.13(CLKIN) U3.13(CLKIN) U5.13(CLKIN) ; off-sheet SD_CLK_Grid
SD_CLK_Vbus: U6.13(CLKIN) ; off-sheet SD_CLK_Vbus
SD_DATA_CapI: U2.11(DATA) ; off-sheet SD_Data_CapI
SD_DATA_GridI: U5.11(DATA) ; off-sheet SD_Data_GridI
SD_DATA_GridV: U3.11(DATA) ; off-sheet SD_Data_GridV
SD_DATA_Vbus: U6.11(DATA) ; off-sheet SD_Data_Vbus
SDSenseGND1: C17.1 C21.2 C22.2 C25.1 C29.2 L2.1 R14.2 R42.1 Rsh1.2 U1.4 U1.5 U2.8(AGND) U4.5(-VO)
NetC1_2: C1.2 J5.2 L2N.1 R20.2
NetC8_1: C8.1 C10.1 F1.1 F1.2 L4.4 RV1.2
NetC10_2: C10.2 C14.2 F3.1 F3.2 L4.1 RV1.1
NetC11_1: C11.1 C12.1 L3.2 U1.7(+5V)
NetC15_2: C15.2 L10.1 U2.14(DVDD)
NetC16_2: C16.2 L11.1 U3.14(DVDD)
NetC19_1: C19.1 C21.1 R42.2 U2.3(VINN)
NetC19_2: C19.2 C22.1 R33.2 R39.2 U2.2(VINP)
NetC20_1: C20.1 C23.1 R44.2 U3.3(VINN)
NetC20_2: C20.2 C24.1 R40.2 U3.2(VINP)
NetC25_2: C25.2 U2.7(NC)
NetC26_2: C26.2 U3.7(NC)
NetC31_1: C31.1 C34.1 R49.2 U5.3(VINN)
NetC31_2: C31.2 C35.1 R46.2 U5.2(VINP)
NetC36_1: C36.1 C38.1 R54.2 U6.3(VINN)
NetC36_2: C36.2 C39.1 R51.2 U6.2(VINP)
NetC37_2: C37.2 U5.7(NC)
NetC40_2: C40.2 U6.7(NC)
NetCN1_3: CN1.3 R29.1
NetCN2_3: CN2.3 R36.1
NetCN3_3: CN3.3 R28.1
NetCN4_3: CN4.3 R35.1
NetCON1_1: CON1.1 F2.1 F2.2
NetD5_2: D5.2 ZD2.1
NetD6_2: D6.2 ZD4.1
NetL1_2: L1.2 U1.1 U1.2
NetL2_2: L2.2 RY1.3
NetL2N_2: L2N.2 RY2.3
NetL12_2: L12.2 U4.1(+VI)
NetL13_1: L13.1 U4.7(+VO)
NetL14_2: L14.2 U7.1(+VI)
NetL15_1: L15.1 U7.7(+VO)
NetL16_2: L16.2 U8.1(+VI)
NetL17_1: L17.1 U8.7(+VO)
NetQ1_1: Q1.1 R9.2 R13.2
NetQ2_1: Q2.1 R21.2 R23.2
NetQ3_1: Q3.1 R10.2 R12.2
NetQ4_1: Q4.1 R22.2 R24.2
NetQ5_3: Q5.3 R30.2 R31.1
NetR2_1: R2.1 R3.1
NetR3_2: R3.2 R5.2
NetR8_1: R8.1 R11.2
NetR11_1: R11.1 R15.2
NetR17_2: R17.2 R20.1
NetR25_2: R25.2 R26.2
NetR26_1: R26.1 R27.1
NetR32_2: R32.2 R37.2
NetR34_2: R34.2 U2.1(AVDD)
NetR37_1: R37.1 R40.1 R41.2
NetR38_2: R38.2 U3.1(AVDD)
NetR43_1: R43.1 R44.1
NetR45_2: R45.2 U5.1(AVDD)
NetR47_2: R47.2 R48.2
NetR48_1: R48.1 R51.1 R52.2
NetR50_2: R50.2 U6.1(AVDD)
NetR53_1: R53.1 R54.1
NetU1_3: U1.3 U1.6
NetZD1_2: ZD1.2 ZD2.2
NetZD3_2: ZD3.2 ZD4.2

Not connected (* = marked no-connect by the designer): CON1 2; RY1 4*; RY2 4*; U2 4(AGND)* 5(NC)* 10(NC)* 12(NC)* 15(NC)*; U3 4(AGND)* 5(NC)* 10(NC)* 12(NC)* 15(NC)*; U5 4(AGND)* 5(NC)* 10(NC)* 12(NC)* 15(NC)*; U6 4(AGND)* 5(NC)* 10(NC)* 12(NC)* 15(NC)*

### Notes on the sheet
- TIDM-HV-1PH-DCAC
- R3
- (in symbol DRV10) +15V; GND; PWM1; PWM2; RESET; FAULT; C; DRV+; DRV-
- (in symbol FET350R) D; G; S
- (in symbol IGBT) C; G; E
- (in symbol ZD123BSM) B

### Library data of the parts
C1 = B32924D3475K: Manufacturer: TDK; Polarized: N; CompType: Capacitor; Value: 4.7uF; U/M: EA; Cap_F: 0.0000047; Tolerance_%: 10; Value1: 0.015 ohm; VDC_V: 630; Value2: 630V; ESR_ohm: 0.015; IRMS_A: 0.457; TaMax_C: 110; SymbolVersion: 2008-07-09; PartNumber: B32924D3475K; PackageReference: B32924_31mm; RoHS: Y; MountType: TH; Technology: Film; Series: B32924; Publisher: Texas Instruments; LatestRevisionDate: 2015-05-08; ComponentLink1Description: Datasheet link; ComponentLink1URL: http://en.tdk.eu/inf/20/20/db/fc_2009/X2_B32921_928.pdf
C3 C5 C6 = C3222P2
  C3 C6: Value: 1uF/630V
  C5: Value: 0.022u/600V
C4 C8 C13 C14 = GRM55DR72J154KW01L: CAP, CERM, 0.15uF, 630V, +/-10%, X7R, 2220; Manufacturer: MuRata; Polarized: N; CompType: Capacitor; Value: 2200pF; U/M: EA; Cap_F: 0.00000015; Tolerance_%: 10; Value1: Unknown; VDC_V: 250VAC; TaMin_C: -55; TaMax_C: 125; SymbolVersion: 2008-07-09; PartNumber: GA355QR7GF222KW01L; PackageReference: 2220; RoHS: Y; Value2: 250VAC; MountType: SMT; Technology: Ceramic; TempCo: X7R; Cap_Case: 2220; Published: 2008-06-19; Publisher: Texas Instruments; LatestRevisionDate: 2014-05-08; ComponentLink1Description: Datasheet link; ComponentLink1URL: http://search.murata.co.jp/Ceramy/PnsearchViewAction.do?HnOFG=ON&HnNFG=ON&SEL_CNT=50&sLang=en&sKey=GRM55DR72J154KW01L&x=9&y=9&search=startwith; Supplier 1: Digi-Key; Supplier Part Number 1: 490-3480-2-ND; Supplier 2: Mouser; Supplier 3: Farnell
C7 = CE1035P2: Value: 470u/450V
C9 C12 = Capacitor: as C45 on sheet CNTL; CompType: Capacitor; SymbolVersion: 2008-07-09; PackageReference: Used in PnP output; Manufacturer: Used in BOM report; PartNumber: Used in BOM report; RoHS: Used in BOM report.  Use Y or N.; MountType: SMT or TH (used in PnP report); ComponentLink1Description: Datasheet Link; ComponentLink1URL: Paste URL for datasheet here; Publisher: Texas Instruments; LatestRevisionDate: 2014-06-06; LatestRevisionNote: Added Alternate PartNumber and Alternate Manufacturer parameters to appropriate components.; Alternate Manufacturer: -; Alternate PartNumber: -
C11 = CE5080R: Value: 10U/16V
C15-C18 C25-C27 C30 C32 C33 C37 C40 = GRM219R71C104KA01D: CAP, CERM, 0.1uF, 16V, +/-10%, X7R, 0805; Manufacturer: MuRata; Polarized: N; CompType: Capacitor; U/M: EA; Cap_F: 0.0000001; Tolerance_%: 10; Value1: Unknown; VDC_V: 16; TaMin_C: -55; TaMax_C: 125; SymbolVersion: 2008-07-09; Value: 0.1uF; PartNumber: GRM219R71C104KA01D; PackageReference: 0805; RoHS: Y; Value2: 16V; MountType: SMT; Technology: Ceramic; TempCo: X7R; Cap_Case: 0805; Published: 2008-06-19; Publisher: Texas Instruments; LatestRevisionDate: 2014-05-08; ComponentLink1Description: Datasheet link; ComponentLink1URL: http://search.murata.co.jp/Ceramy/PnsearchViewAction.do?HnOFG=ON&HnNFG=ON&SEL_CNT=50&sLang=en&sKey=GRM219R71C104KA01D&x=9&y=9&search=startwith; Supplier 1: Digi-Key; Supplier Part Number 1: 490-1683-1-ND; Supplier 2: Mouser; Supplier Part Number 2: 81-GRM40X104K16D
C19 C20 C31 C36 = 08055C331KAT2A: CAP, CERM, 330pF, 50V, +/-10%, X7R, 0805; Manufacturer: AVX; Polarized: N; CompType: Capacitor; U/M: EA; Cap_F: 0.00000000033; Tolerance_%: 10; ESR_Ohm: 0.563; Value1: 0.563 ohm; VDC_V: 50; TaMin_C: -55; TaMax_C: 125; Cap_Case: 0805; SymbolVersion: 2008-07-09; Value: 330pF; PartNumber: 08055C331KAT2A; PackageReference: 0805; RoHS: Y; Value2: 50V; MountType: SMT; Technology: Ceramic; TempCo: X7R; Published: 2008-06-19; Publisher: Texas Instruments; LatestRevisionDate: 2014-05-08; ComponentLink1Description: Datasheet link; ComponentLink1URL: http://www.avx.com/docs/masterpubs/smccp.pdf; Supplier 1: Digi-Key; Supplier Part Number 1: 478-1365-1-ND; Supplier 2: Mouser; Supplier Part Number 2: 581-08055C331K; Supplier 3: Farnell; Supplier Part Number 3: 1395751
C21-C24 C34 C35 C38 C39 = 08055A100JAT2A: CAP, CERM, 10pF, 50V, +/-5%, C0G/NP0, 0805; Manufacturer: AVX; Polarized: N; CompType: Capacitor; U/M: EA; Cap_F: 0.00000000001; Tolerance_%: 5; ESR_Ohm: 1.561; Value1: 1.561 ohm; VDC_V: 50; TaMin_C: -55; TaMax_C: 125; Cap_Case: 0805; SymbolVersion: 2008-07-09; Value: 10pF; PartNumber: 08055A100JAT2A; PackageReference: 0805; RoHS: Y; Value2: 50V; MountType: SMT; Technology: Ceramic; TempCo: C0G/NP0; Published: 2008-06-19; Publisher: Texas Instruments; LatestRevisionDate: 2014-05-08; ComponentLink1Description: Datasheet link; ComponentLink1URL: http://www.avx.com/docs/masterpubs/smccp.pdf; Supplier 1: Digi-Key; Supplier Part Number 1: 478-1304-1-ND; Supplier 2: Mouser; Supplier Part Number 2: 581-08055A100J; Supplier 3: Farnell; Supplier Part Number 3: 1395941
C28 C29 C41-C44 = TMK212BJ105KG-T: CAP, CERM, 1uF, 20V, +/-10%, X5R, 0805; Manufacturer: Taiyo Yuden; Polarized: N; CompType: Capacitor; U/M: EA; Cap_F: 0.000001; Tolerance_%: 10; Value1: Unknown; VDC_V: 20; TaMin_C: -55; TaMax_C: 85; SymbolVersion: 2008-07-09; Value: 1uF; PartNumber: TMK212BJ105KG-T; PackageReference: 0805; RoHS: Y; Value2: 20V; MountType: SMT; Technology: Ceramic; TempCo: X5R; Cap_Case: 0805; Published: 2008-06-19; Publisher: Texas Instruments; LatestRevisionDate: 2014-05-08; ComponentLink1Description: Datasheet link; ComponentLink1URL: http://www.yuden.co.jp/ut/product/pdf/djmk_e.pdf; Supplier 1: Digi-Key; Supplier Part Number 1: 587-1291-1-ND; Supplier 2: Farnell; Supplier Part Number 2: 8031575; Supplier 3: Newark; Supplier Part Number 3: 18J2754
CN1-CN4 = DRV10
CON1 = CN25P03: Value: {Value}
D1-D4 = C3D08060A: Diode, Schottky, 600V, 8A, TH; Manufacturer: Infineon; U/M: EA; Vf_V: 1.5; Value: 650V; Value1: 6A; Value2: 1.5V; Io_A: 6; Vr_V: 650; TJmax_C: 175; Type: SiC; CompType: Diode; SymbolVersion: 2008-12-08; PartNumber: IDH06G65C5; PackageReference: TO-220-2; RJC_CperW: 1.5; MountType: TH; RoHS: Y; Published: 2008-06-26; Publisher: Texas Instruments; LatestRevisionDate: 2015-05-12; ComponentLink1Description: Datasheet link; ComponentLink1URL: http://www.cree.com/~/media/Files/Cree/Power/Data%20Sheets/C3D08060A.pdf; Supplier 1: Digi-Key; Supplier 2: Mouser; Supplier 3: Farnell
D5 D6 = D10626A: Value: 1N4937S
H1-H4 = 513201B02500G: HEATSINK TO-218/TO-247 W/PINS 2"; Manufacturer: Aavid; SymbolCreator: a0412235; SymbolVersion: 2013-07-05; CompType: Heat Sink; PartNumber: 513201B02500G; RoHS: Y; PackageReference: 12.70x50.80x34.92 mm; MountType: N/A; ComponentLink1Description: Datasheet Link; ComponentLink1URL: http://www.aavid.com/sites/default/files/literature/Aavid-Board-Level-Heatsinks-Catalog.pdf#page=58; Publisher: Texas Instruments; LatestRevisionDate: 2014-06-05; Supplier 1: Digi-Key; Supplier Part Number 1: HS347-ND; Supplier 2: Mouser; Supplier Part Number 2: 532-513201B25G
J1 = CONN_AC_HP-TYPE: Connector, AC Board mount, 9mm; Manufacturer: Qualtek Electronics; PartNumber: 703W-00/54; Area: 1.64 inch; Value: 703W-00/54; ComponentHeight: 1.100 inch; SymbolVersion: 12/07/2011 14:54:18; PackageReference: 1.97 x 0.79 inch; ComponentLink1URL: C:\program files\p-cad2004pcad_pdf's\; ComponentLink1Description: AEO Datasheet Link
J5 = Pwr_Short: SymbolVersion: use current date i.e. 2008-05-20; SymbolCreator: Use a-id; CompType: Used in some BOM reports.  Useful for finding later.; U/M: EA, IN, or GM; Manufacturer: Used in BOM report; MountType: SMT, TH, or N/A; RoHS: Used in BOM report.  Use Y or N.; PartNumber: Used in BOM report; PackageReference: eg:  0603, used in PnP report; ComponentLink1Description: Datasheet Link; Alternate PartNumber: -; Alternate Manufacturer: -
L1 = RC1212P2: Custom; Value: 3mH/T184-8/90
L2 L2N = 1140-471K-RC
L3 L5-L9 = HI1206N101R-10: Ferrite Bead, 100 ohm @ 100MHz, 3A, 1206; Manufacturer: Laird-Signal Integrity Products; Imax_A: 3; DCR_ohm: 0.035; Value1: 0.035 ohm; ZTyp@100MHz_Ohm: 100; Ztyp@1GHz_Ohm: 145; CompType: Ferrite Bead; SymbolVersion: 2009-06-02; PartNumber: HI1206N101R-10; Value2: 3A; MountType: SMT; PackageReference: 1206; Published: 2014-04-30; Publisher: Texas Instruments; LatestRevisionDate: 2014-04-30; ComponentLink1Description: Datasheet link; ComponentLink1URL: http://www.lairdtech.com/DownloadAsset.aspx?id=4847; RoHS: Y; Supplier 1: Digi-Key; Supplier Part Number 1: 240-2408-1-ND; Supplier 2: Mouser; Supplier Part Number 2: 875-HI1206N101R-10; Supplier 3: Farnell; Supplier Part Number 3: 1697228
L10-L17 = MMZ2012R300A: as L18 on sheet CNTL; CompType: Ferrite Bead; SymbolVersion: 2009-06-02; PartNumber: LQM21FN220N00L; MountType: SMT; PackageReference: 0805; Published: 2014-04-30; Publisher: Texas Instruments; LatestRevisionDate: 2014-04-30; ComponentLink1Description: Datasheet link; ComponentLink1URL: http://www.digikey.com/product-detail/en/LQM21FN220N00L/490-4030-1-ND/1016290; RoHS: Y; Supplier 1: Digi-Key; Supplier Part Number 1: 490-4030-1-ND; Supplier 2: Mouser; Supplier 3: Farnell
Q1-Q4 = IGBT: Manufacturer: Infineon; SymbolVersion: use current date i.e. 2008-05-20; SymbolCreator: Use a-id; CompType: Used in some BOM reports.  Useful for finding later.; U/M: EA, IN, or GM; MountType: TH; RoHS: Y; PartNumber: IGP20N65H5; PackageReference: TO-220-3; ComponentLink1Description: Datasheet Link; Alternate PartNumber: -; Alternate Manufacturer: -
Q5 = FET350R: Value: 2SK2962
R2 R3 R5 R25-R31 R35 R36 = R0805BSM
  R2 R3 R5 R25-R27: Value: 1MSM1%(0805)
  R28 R29 R35 R36: Value: 1.33KSM/0.5W
  R30: Value: 150OHMSM(0805)F
  R31: Value: 3KSM*(0805)F
R6 R7 R9 R10 R12 R13 R18 R19 R21-R24 = ERJ14NF5110U: RES, 47Kohm, 1%, 0.5W, 1210; Manufacturer: Panasonic; CompType: Resistor; Tolerance_%: 1; Value1: 5%; Power_W: 0.5; VDC_V: 16; TempCo: 100 ppm/C; EIA_Code: E96; U/M: EA; SymbolVersion: 2009-05-29; PackageReference: 1210; RoHS: Y; Value2: 0.5W; MountType: SMT; Technology: Thick Film; Published: 2008-06-26; Publisher: Texas Instruments; LatestRevisionDate: 2014-05-02; ComponentLink1Description: Datasheet link; ComponentLink1URL: http://www.panasonic.com/industrial/components/pdf/AOA0000CE2.pdf; Supplier 1: Digi-Key
  R6 R7 R12 R13 R18 R19 R23 R24: Res_ohm: 47K
  R9 R10 R21 R22: Res_ohm: 10
R8 R11 R15 = Resistor: RES, 1M ohm, 1%, xW, [PackageReference]; U/M: EA; CompType: Resistor; SymbolVersion: 2009-05-29; PackageReference: 0805; Manufacturer: Used in BOM report; PartNumber: Used in BOM report; RoHS: Used in BOM report.  Use Y or N.; ComponentLink1Description: Datasheet Link; ComponentLink1URL: Paste URL for datasheet here; Publisher: Texas Instruments; LatestRevisionDate: 2014-06-06; LatestRevisionNote: Added Alternate PartNumber and Alternate Manufacturer parameters to appropriate components.; Alternate Manufacturer: -; Alternate PartNumber: -
  R8: MountType: SMT
  R11 R15: MountType: SMT or TH (used in PnP report)
R14 R41 R43 R52 R53 = CRCW08051K62FKEA: RES, 2.4k ohm, 1%, 0.125W, 0805; Manufacturer: Vishay-Dale; CompType: Resistor; Res_ohm: 1620; Value_Code: 1k62; Tolerance_%: 1; Power_W: 0.125; VDC_V: 150; TempCo: 100 ppm/C; EIA_Code: E96; U/M: EA; SymbolVersion: 2009-05-29; PartNumber: CRCW08051K62FKEA; PackageReference: 0805; RoHS: Y; Value1: 1%; Value2: 0.125W; MountType: SMT; Technology: Thick Film; Published: 2008-06-26; Publisher: Texas Instruments; LatestRevisionDate: 2014-04-18; ComponentLink1Description: Datasheet link; ComponentLink1URL: http://www.vishay.com/docs/20035/dcrcwe3.pdf; Supplier 1: Digi-Key; Supplier Part Number 1: 541-1.62KCCT-ND; Supplier 2: Mouser; Supplier Part Number 2: 71-CRCW0805-1.62K-E3; Supplier 3: Farnell; Supplier Part Number 3: 1152192
R16 = Resistor: RES, 11K ohm, 1%, xW, [PackageReference]; U/M: EA; CompType: Resistor; SymbolVersion: 2009-05-29; PackageReference: Used in PnP output; Manufacturer: Used in BOM report; PartNumber: Used in BOM report; RoHS: Used in BOM report.  Use Y or N.; MountType: SMT or TH (used in PnP report); ComponentLink1Description: Datasheet Link; ComponentLink1URL: Paste URL for datasheet here; Publisher: Texas Instruments; LatestRevisionDate: 2014-06-06; LatestRevisionNote: Added Alternate PartNumber and Alternate Manufacturer parameters to appropriate components.; Alternate Manufacturer: -; Alternate PartNumber: -
R17 R20 R32 R37 R47 R48 = CRCW08051M00FKEA: RES, 2.00Meg ohm, 1%, 0.125W, 0805; Manufacturer: Vishay-Dale; CompType: Resistor; Res_ohm: 1000000; Value_Code: 1M00; Tolerance_%: 1; Power_W: 0.125; VDC_V: 150; TempCo: 100 ppm/C; EIA_Code: E96; U/M: EA; SymbolVersion: 2009-05-29; PartNumber: CRCW08051M00FKEA; PackageReference: 0805; RoHS: Y; Value1: 1%; Value2: 0.125W; MountType: SMT; Technology: Thick Film; Published: 2008-06-26; Publisher: Texas Instruments; LatestRevisionDate: 2014-04-18; ComponentLink1Description: Datasheet link; ComponentLink1URL: http://www.vishay.com/docs/20035/dcrcwe3.pdf; Supplier 1: Digi-Key; Supplier Part Number 1: 541-1.00MCCT-ND; Supplier 2: Mouser; Supplier Part Number 2: 71-CRCW0805-1.0M-E3; Supplier 3: Farnell; Supplier Part Number 3: 1652946
R33 R39 R40 R42 R44 R46 R49 R51 R54 = CRCW080512R0JNEA: RES, 12 ohm, 5%, 0.125W, 0805; Manufacturer: Vishay-Dale; CompType: Resistor; Value_Code: 12R0; Tolerance_%: 5; Power_W: 0.125; VDC_V: 150; TempCo: 200 ppm/C; EIA_Code: E24; U/M: EA; SymbolVersion: 2009-05-29; PartNumber: CRCW080512R0JNEA; PackageReference: 0805; RoHS: Y; Value1: 5%; Value2: 0.125W; MountType: SMT; Technology: Thick Film; Published: 2008-06-26; Publisher: Texas Instruments; LatestRevisionDate: 2014-04-18; ComponentLink1Description: Datasheet link; ComponentLink1URL: http://www.vishay.com/docs/20035/dcrcwe3.pdf; Supplier 1: Digi-Key; Supplier Part Number 1: 541-12ACT-ND; Supplier 2: Mouser; Supplier Part Number 2: 71-CRCW080512R0JNEA; Supplier 3: Farnell; Supplier Part Number 3: 1739203
  R33: Res_ohm: DNP
  R39 R40 R42 R44 R46 R49 R51 R54: Res_ohm: 12
R34 R38 R45 R50 = RC0805JR-071R1L: RES, 1.1 ohm, 5%, 0.125W, 0805; Manufacturer: Yageo America; CompType: Resistor; Value_Code: 1R10; Tolerance_%: 5; Power_W: 0.125; VDC_V: 150; TempCo: 200 ppm/C; EIA_Code: E24; U/M: EA; SymbolVersion: 2009-05-29; PartNumber: RC0805JR-071R1L; PackageReference: 0805; RoHS: Y; Res_ohm: 1.1; Value1: 5%; Value2: 0.125W; MountType: SMT; Technology: Thick Film; Published: 2008-06-26; Publisher: Texas Instruments; LatestRevisionDate: 2014-04-18; ComponentLink1Description: Datasheet link; ComponentLink1URL: http://www.yageo.com/pdf/Pu-RC0805_51_PbFree_L_2.pdf; Supplier 1: Digi-Key; Supplier Part Number 1: 311-1.1ARCT-ND; Supplier 2: Mouser; Supplier Part Number 2: 603-RC0805JR-071R1L; Supplier 3: Farnell; Supplier Part Number 3: 1799483
Rsh1 Rsh2 = 73M1R010F: RES, 0.01 ohm, 1%, 1W, 2512; Manufacturer: CTS Resistor; CompType: Resistor; Value_Code: R010; Tolerance_%: 1; TempCo: 100 ppm/C; EIA_Code: E96; U/M: EA; SymbolVersion: 2009-05-29; PartNumber: 73M1R010F; PackageReference: 2512; RoHS: Y; Res_ohm: 0.01; Value1: 1%; Power_W: 1; Value2: 1W; MountType: SMT; Technology: Thick Film; Published: 2008-06-26; Publisher: Texas Instruments; LatestRevisionDate: 2014-05-02; ComponentLink1Description: Datasheet link; ComponentLink1URL: http://www.ctscorp.com/components/Datasheets/CSR-MetalPlate.pdf; Supplier 1: Digi-Key; Supplier Part Number 1: 73M1R010FCT-ND; Supplier 2: Mouser; Supplier Part Number 2: 774-73M1R010F
RV1 = S10K275E2: Varistor 275V RMS 10MM Radial, TH; Manufacturer: EPCOS Inc; SymbolCreator: a0412235; SymbolVersion: 2012-06-04; PartNumber: S10K275E2; Value: 275V; MountType: TH; ComponentLink1Description: Datasheet URL; ComponentLink1URL: http://www.epcos.com/inf/70/db/var_08/SIOV_Leaded_AdvanceD.pdf; RoHS: Y; PackageReference: 10mm Radial; Publisher: Texas Instruments; LatestRevisionDate: 2014-04-23; Supplier 1: Digi-Key; Supplier Part Number 1: 495-1433-ND
RY1 RY2 = RY201-1C
TP1 TP2 = PIN1: ZR
U1 = LTSR 6-NP: Current Transducer, AC/DC, 6A, TH; Manufacturer: LEM; SymbolCreator: Altium; SymbolVersion: 2015-05-22; PartNumber: LTSR 6-NP; MountType: TH; ComponentLink1Description: Datasheet Link; ComponentLink1URL: http://www.lem.com/docs/products/ltsr%206-np.pdf; RoHS: Y; PackageReference: 10x22.2mm; Publisher: Texas Instruments; LatestRevisionDate: 2015-05-26; Supplier 1: Digi-Key; Supplier Part Number 1: 398-1021-5-ND
U2 U3 U5 U6 = AMC1204DW: 20MHz, Second-Order, Isolated Delta-Sigma Modulator for Current-Shunt Measurement, DW0016A; Alternate Manufacturer: None; Manufacturer: Texas Instruments; SymbolCreator: a0411947; CompType: IC; U/M: EA; SymbolVersion: 2013-08-29; PartNumber: AMC1204DW; PackageReference: DW0016A; MountType: SMT; ComponentLink1Description: Datasheet Link; ComponentLink1URL: http://www.ti.com/lit/ds/symlink/amc1204.pdf; RoHS: Y; Publisher: Texas Instruments; LatestRevisionDate: 2014-05-12
U4 U7 U8 = DCH010505SN7: IC, Miniature, 1-W, 3-kV Isolated Unregulated DC/DC Converters; Manufacturer: TI; Alternate Manufacturer: None; Area: 298800; ComponentHeight: 10.15 mm; SymbolVersion: 05/02/2012 09:23:03; PartNumber: DCH010505SN7; ComponentLink1URL: \\vette02\pmp_pcb\pcad_pdf's\dch010505s.pdf; PackageReference: SIP; Value: DCH010505SN7; ComponentLink1Description: AEO Datasheet Link
ZD1-ZD4 = ZD123BSM: Value: 15VCSM/22131